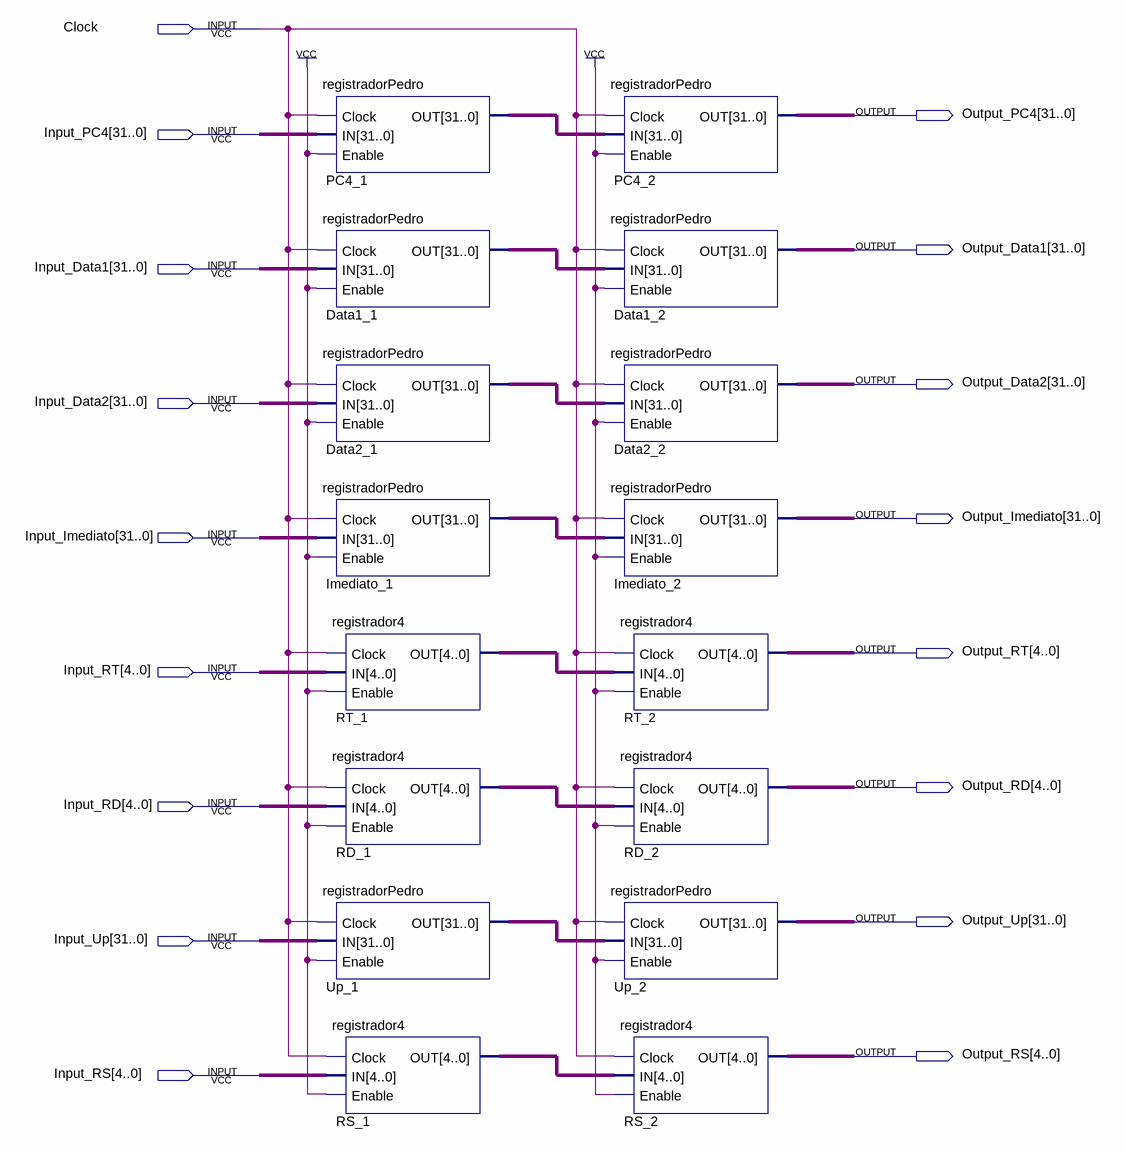
[diagram p0: schematic sheet]
// Quartus schematic barreira_ID_EX.bdf as structural Verilog: 16 symbols, 17 pins
module barreira_ID_EX (
  input  Clock,
  input  [31:0] Input_PC4,
  input  [31:0] Input_Data1,
  input  [31:0] Input_Data2,
  input  [31:0] Input_Imediato,
  input  [4:0] Input_RT,
  input  [4:0] Input_RD,
  input  [31:0] Input_Up,
  input  [4:0] Input_RS,
  output [31:0] Output_PC4,
  output [31:0] Output_Data1,
  output [31:0] Output_Data2,
  output [31:0] Output_Imediato,
  output [4:0] Output_RT,
  output [4:0] Output_RD,
  output [31:0] Output_Up,
  output [4:0] Output_RS
);

  wire [4:0] RD_1_out, RS_1_out, RT_1_out;
  wire [31:0] Data1_1_out, Data2_1_out, Imediato_1_out, PC4_1_out, Up_1_out;

  registradorPedro PC4_1 (.Clock(Clock), .IN(Input_PC4), .Enable(1'b1), .OUT(PC4_1_out));
  registradorPedro Data1_1 (.Clock(Clock), .IN(Input_Data1), .Enable(1'b1), .OUT(Data1_1_out));
  registradorPedro Data2_1 (.Clock(Clock), .IN(Input_Data2), .Enable(1'b1), .OUT(Data2_1_out));
  registradorPedro Imediato_1 (.Clock(Clock), .IN(Input_Imediato), .Enable(1'b1), .OUT(Imediato_1_out));
  registrador4 RT_1 (.Clock(Clock), .IN(Input_RT), .Enable(1'b1), .OUT(RT_1_out));
  registrador4 RD_1 (.Clock(Clock), .IN(Input_RD), .Enable(1'b1), .OUT(RD_1_out));
  registradorPedro Up_1 (.Clock(Clock), .IN(Input_Up), .Enable(1'b1), .OUT(Up_1_out));
  registrador4 RS_1 (.Clock(Clock), .IN(Input_RS), .Enable(1'b1), .OUT(RS_1_out));
  registradorPedro PC4_2 (.Clock(Clock), .IN(PC4_1_out), .Enable(1'b1), .OUT(Output_PC4));
  registradorPedro Data1_2 (.Clock(Clock), .IN(Data1_1_out), .Enable(1'b1), .OUT(Output_Data1));
  registradorPedro Data2_2 (.Clock(Clock), .IN(Data2_1_out), .Enable(1'b1), .OUT(Output_Data2));
  registradorPedro Imediato_2 (.Clock(Clock), .IN(Imediato_1_out), .Enable(1'b1), .OUT(Output_Imediato));
  registrador4 RT_2 (.Clock(Clock), .IN(RT_1_out), .Enable(1'b1), .OUT(Output_RT));
  registrador4 RD_2 (.Clock(Clock), .IN(RD_1_out), .Enable(1'b1), .OUT(Output_RD));
  registradorPedro Up_2 (.Clock(Clock), .IN(Up_1_out), .Enable(1'b1), .OUT(Output_Up));
  registrador4 RS_2 (.Clock(Clock), .IN(RS_1_out), .Enable(1'b1), .OUT(Output_RS));
endmodule
